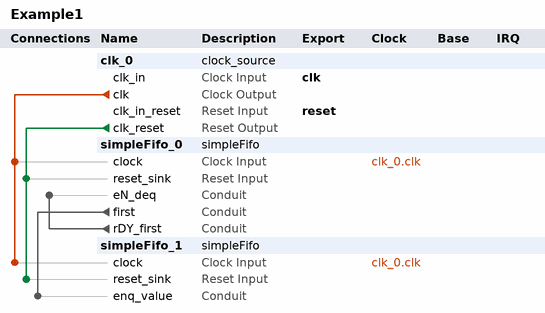
[diagram p0: system contents]
# Platform Designer (Qsys) system Example1, Cyclone V 5CGXFC7C7F23C8
# Parameters at their usual value, and those the tool derives, are not listed.
package require -exact qsys 21.1
create_system Example1
set_project_property DEVICE_FAMILY {Cyclone V}
set_project_property DEVICE 5CGXFC7C7F23C8

add_instance clk_0 clock_source 21.1
set_instance_parameter_value clk_0 clockFrequency 50000000

add_instance simpleFifo_0 simpleFifo 1.0

add_instance simpleFifo_1 simpleFifo 1.0

# connections
add_connection clk_0.clk simpleFifo_0.clock clock
add_connection clk_0.clk simpleFifo_1.clock clock
add_connection clk_0.clk_reset simpleFifo_0.reset_sink reset
add_connection clk_0.clk_reset simpleFifo_1.reset_sink reset
add_connection simpleFifo_0.first simpleFifo_1.enq_value conduit
add_connection simpleFifo_0.rDY_first simpleFifo_0.eN_deq conduit

# exported interfaces
add_interface clk clock sink
set_interface_property clk EXPORT_OF clk_0.clk_in
add_interface reset reset sink
set_interface_property reset EXPORT_OF clk_0.clk_in_reset

set_interconnect_requirement {$system} qsys_mm.clockCrossingAdapter HANDSHAKE
set_interconnect_requirement {$system} qsys_mm.enableEccProtection FALSE
set_interconnect_requirement {$system} qsys_mm.insertDefaultSlave FALSE
set_interconnect_requirement {$system} qsys_mm.maxAdditionalLatency 1

save_system Example1.qsys
